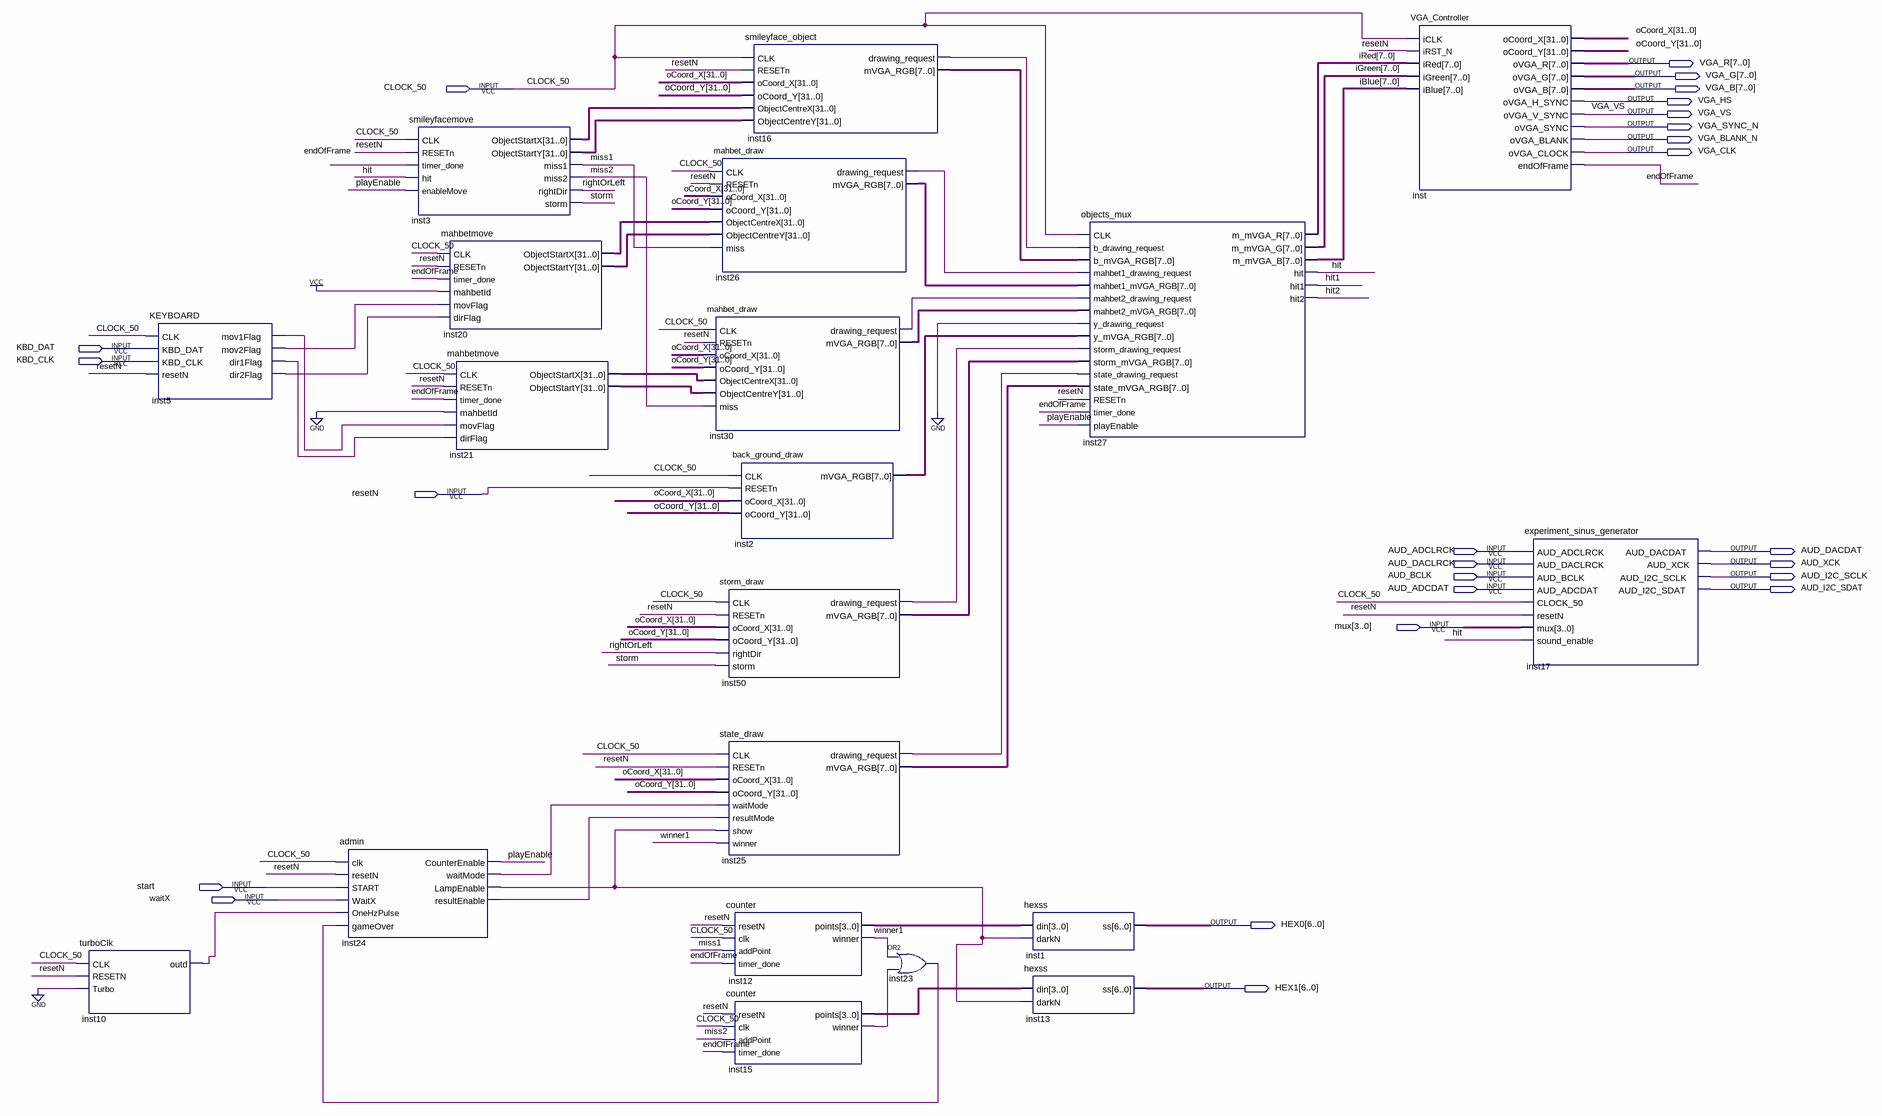
[diagram p0: schematic sheet]
// Quartus schematic TOP_SIFTACH.bdf as structural Verilog: 20 symbols, 25 pins
module TOP_SIFTACH (
  input  CLOCK_50,
  input  KBD_DAT,
  input  KBD_CLK,
  input  resetN,
  input  AUD_ADCLRCK,
  input  AUD_DACLRCK,
  input  AUD_BCLK,
  input  AUD_ADCDAT,
  input  [3:0] mux,
  input  start,
  input  waitX,
  output [7:0] VGA_R,
  output [7:0] VGA_G,
  output [7:0] VGA_B,
  output VGA_HS,
  output VGA_VS,
  output VGA_SYNC_N,
  output VGA_BLANK_N,
  output VGA_CLK,
  output AUD_DACDAT,
  output AUD_XCK,
  output AUD_I2C_SCLK,
  output AUD_I2C_SDAT,
  output [6:0] HEX0,
  output [6:0] HEX1
);

  wire endOfFrame, hit, hit1, hit2, inst5_dir1flag, inst5_dir2flag, inst5_mov1flag, inst5_mov2flag,
       inst10_outd, inst15_winner, inst16_drawing_request, inst23_out, inst24_lampenable,
       inst24_resultenable, inst24_waitmode, inst25_drawing_request, inst26_drawing_request,
       inst30_drawing_request, inst50_drawing_request, miss1, miss2, playEnable, rightOrLeft, storm, winner1;
  wire [3:0] inst12_points, inst15_points;
  wire [7:0] iBlue, iGreen, inst2_mvga_rgb, inst16_mvga_rgb, inst25_mvga_rgb, inst26_mvga_rgb,
       inst30_mvga_rgb, inst50_mvga_rgb, iRed;
  wire [31:0] inst3_objectstartx, inst3_objectstarty, inst20_objectstartx, inst20_objectstarty,
       inst21_objectstartx, inst21_objectstarty, oCoord_X, oCoord_Y;

  turboClk inst10 (.CLK(CLOCK_50), .RESETN(resetN), .Turbo(1'b0), .outd(inst10_outd));
  KEYBOARD inst5 (
    .CLK(CLOCK_50), .KBD_DAT(KBD_DAT), .KBD_CLK(KBD_CLK), .resetN(resetN), .mov1Flag(inst5_mov1flag),
    .mov2Flag(inst5_mov2flag), .dir1Flag(inst5_dir1flag), .dir2Flag(inst5_dir2flag));
  admin inst24 (
    .clk(CLOCK_50), .resetN(resetN), .START(start), .WaitX(waitX), .OneHzPulse(inst10_outd),
    .gameOver(inst23_out), .CounterEnable(playEnable), .waitMode(inst24_waitmode),
    .LampEnable(inst24_lampenable), .resultEnable(inst24_resultenable));
  smileyfacemove inst3 (
    .CLK(CLOCK_50), .RESETn(resetN), .timer_done(endOfFrame), .hit(hit), .enableMove(playEnable),
    .ObjectStartX(inst3_objectstartx), .ObjectStartY(inst3_objectstarty), .miss1(miss1), .miss2(miss2),
    .rightDir(rightOrLeft), .storm(storm));
  mahbetmove inst20 (
    .CLK(CLOCK_50), .RESETn(resetN), .timer_done(endOfFrame), .mahbetId(1'b1), .movFlag(inst5_mov2flag),
    .dirFlag(inst5_dir2flag), .ObjectStartX(inst20_objectstartx), .ObjectStartY(inst20_objectstarty));
  mahbetmove inst21 (
    .CLK(CLOCK_50), .RESETn(resetN), .timer_done(endOfFrame), .mahbetId(1'b0), .movFlag(inst5_mov1flag),
    .dirFlag(inst5_dir1flag), .ObjectStartX(inst21_objectstartx), .ObjectStartY(inst21_objectstarty));
  mahbet_draw inst26 (
    .CLK(CLOCK_50), .RESETn(resetN), .oCoord_X(oCoord_X), .oCoord_Y(oCoord_Y),
    .ObjectCentreX(inst20_objectstartx), .ObjectCentreY(inst20_objectstarty), .miss(miss1),
    .drawing_request(inst26_drawing_request), .mVGA_RGB(inst26_mvga_rgb));
  mahbet_draw inst30 (
    .CLK(CLOCK_50), .RESETn(resetN), .oCoord_X(oCoord_X), .oCoord_Y(oCoord_Y),
    .ObjectCentreX(inst21_objectstartx), .ObjectCentreY(inst21_objectstarty), .miss(miss2),
    .drawing_request(inst30_drawing_request), .mVGA_RGB(inst30_mvga_rgb));
  storm_draw inst50 (
    .CLK(CLOCK_50), .RESETn(resetN), .oCoord_X(oCoord_X), .oCoord_Y(oCoord_Y), .rightDir(rightOrLeft),
    .storm(storm), .drawing_request(inst50_drawing_request), .mVGA_RGB(inst50_mvga_rgb));
  state_draw inst25 (
    .CLK(CLOCK_50), .RESETn(resetN), .oCoord_X(oCoord_X), .oCoord_Y(oCoord_Y), .waitMode(inst24_waitmode),
    .resultMode(inst24_resultenable), .show(inst24_lampenable), .winner(winner1),
    .drawing_request(inst25_drawing_request), .mVGA_RGB(inst25_mvga_rgb));
  counter inst12 (
    .resetN(resetN), .clk(CLOCK_50), .addPoint(miss1), .timer_done(endOfFrame), .points(inst12_points),
    .winner(winner1));
  counter inst15 (
    .resetN(resetN), .clk(CLOCK_50), .addPoint(miss2), .timer_done(endOfFrame), .points(inst15_points),
    .winner(inst15_winner));
  smileyface_object inst16 (
    .CLK(CLOCK_50), .RESETn(resetN), .oCoord_X(oCoord_X), .oCoord_Y(oCoord_Y),
    .ObjectCentreX(inst3_objectstartx), .ObjectCentreY(inst3_objectstarty),
    .drawing_request(inst16_drawing_request), .mVGA_RGB(inst16_mvga_rgb));
  back_ground_draw inst2 (
    .CLK(CLOCK_50), .RESETn(resetN), .oCoord_X(oCoord_X), .oCoord_Y(oCoord_Y), .mVGA_RGB(inst2_mvga_rgb));
  or inst23 (inst23_out, winner1, inst15_winner);
  hexss inst1 (.din(inst12_points), .darkN(inst24_lampenable), .ss(HEX0));
  hexss inst13 (.din(inst15_points), .darkN(inst24_lampenable), .ss(HEX1));
  objects_mux inst27 (
    .CLK(CLOCK_50), .b_drawing_request(inst16_drawing_request), .b_mVGA_RGB(inst16_mvga_rgb),
    .mahbet1_drawing_request(inst26_drawing_request), .mahbet1_mVGA_RGB(inst26_mvga_rgb),
    .mahbet2_drawing_request(inst30_drawing_request), .mahbet2_mVGA_RGB(inst30_mvga_rgb),
    .y_drawing_request(1'b0), .y_mVGA_RGB(inst2_mvga_rgb), .storm_drawing_request(inst50_drawing_request),
    .storm_mVGA_RGB(inst50_mvga_rgb), .state_drawing_request(inst25_drawing_request),
    .state_mVGA_RGB(inst25_mvga_rgb), .RESETn(resetN), .timer_done(endOfFrame), .playEnable(playEnable),
    .m_mVGA_R(iRed), .m_mVGA_G(iGreen), .m_mVGA_B(iBlue), .hit(hit), .hit1(hit1), .hit2(hit2));
  VGA_Controller inst (
    .iCLK(CLOCK_50), .iRST_N(resetN), .iRed(iRed), .iGreen(iGreen), .iBlue(iBlue), .oCoord_X(oCoord_X),
    .oCoord_Y(oCoord_Y), .oVGA_R(VGA_R), .oVGA_G(VGA_G), .oVGA_B(VGA_B), .oVGA_H_SYNC(VGA_HS),
    .oVGA_V_SYNC(VGA_VS), .oVGA_SYNC(VGA_SYNC_N), .oVGA_BLANK(VGA_BLANK_N), .oVGA_CLOCK(VGA_CLK),
    .endOfFrame(endOfFrame));
  experiment_sinus_generator inst17 (
    .AUD_ADCLRCK(AUD_ADCLRCK), .AUD_DACLRCK(AUD_DACLRCK), .AUD_BCLK(AUD_BCLK), .AUD_ADCDAT(AUD_ADCDAT),
    .CLOCK_50(CLOCK_50), .resetN(resetN), .mux(mux), .sound_enable(hit), .AUD_DACDAT(AUD_DACDAT),
    .AUD_XCK(AUD_XCK), .AUD_I2C_SCLK(AUD_I2C_SCLK), .AUD_I2C_SDAT(AUD_I2C_SDAT));
endmodule
